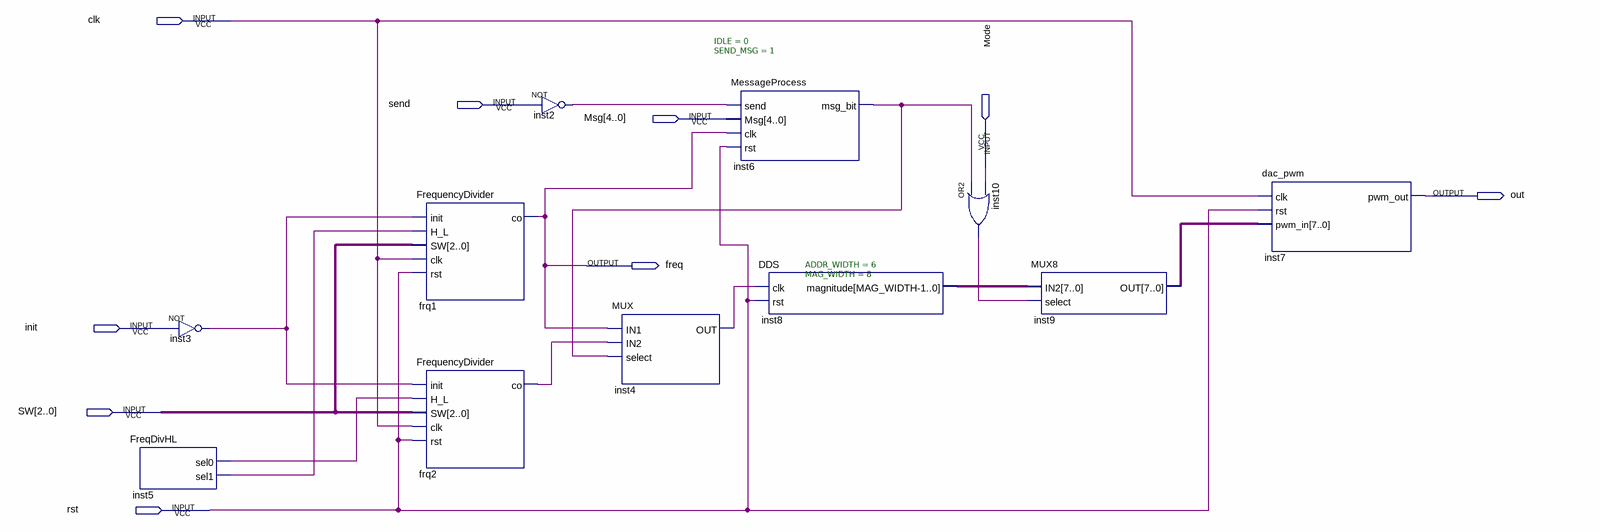
[diagram p0: schematic sheet]
// Quartus schematic DigitalModulation.bdf as structural Verilog: 11 symbols, 9 pins
module DigitalModulation (
  input  clk,
  input  send,
  input  [4:0] Msg,
  input  Mode,
  input  init,
  input  [2:0] SW,
  input  rst,
  output out,
  output freq
);

  wire frq2_co, inst2_out, inst3_out, inst4_out, inst5_sel0, inst5_sel1, inst6_msg_bit, inst10_out;
  wire [7:0] inst8_magnitude, inst9_out;

  FreqDivHL inst5 (.sel0(inst5_sel0), .sel1(inst5_sel1));
  not inst3 (inst3_out, init);
  FrequencyDivider frq1 (.init(inst3_out), .H_L(inst5_sel1), .SW(SW), .clk(clk), .rst(rst), .co(freq));
  FrequencyDivider frq2 (.init(inst3_out), .H_L(inst5_sel0), .SW(SW), .clk(clk), .rst(rst), .co(frq2_co));
  not inst2 (inst2_out, send);
  MUX inst4 (.IN1(freq), .IN2(frq2_co), .select(inst6_msg_bit), .OUT(inst4_out));
  MessageProcess #(.IDLE(0), .SEND_MSG(1)) inst6 (
    .send(inst2_out), .Msg(Msg), .clk(freq), .rst(rst), .msg_bit(inst6_msg_bit));
  DDS #(.ADDR_WIDTH(6), .MAG_WIDTH(8)) inst8 (.clk(inst4_out), .rst(rst), .magnitude(inst8_magnitude));
  or inst10 (inst10_out, inst6_msg_bit, Mode);
  MUX8 inst9 (.IN2(inst8_magnitude), .select(inst10_out), .OUT(inst9_out));
  dac_pwm inst7 (.clk(clk), .rst(rst), .pwm_in(inst9_out), .pwm_out(out));
endmodule
